# Altium schematic sheet EECS430PhasedArray.SchDoc
size B; ENG_APP_DATE: --/--/--; DSN_APP_DATE: --/--/--; CHK_APP_DATE: --/--/--; Organization: MASA; SheetNumber: 1; SheetTotal: 6
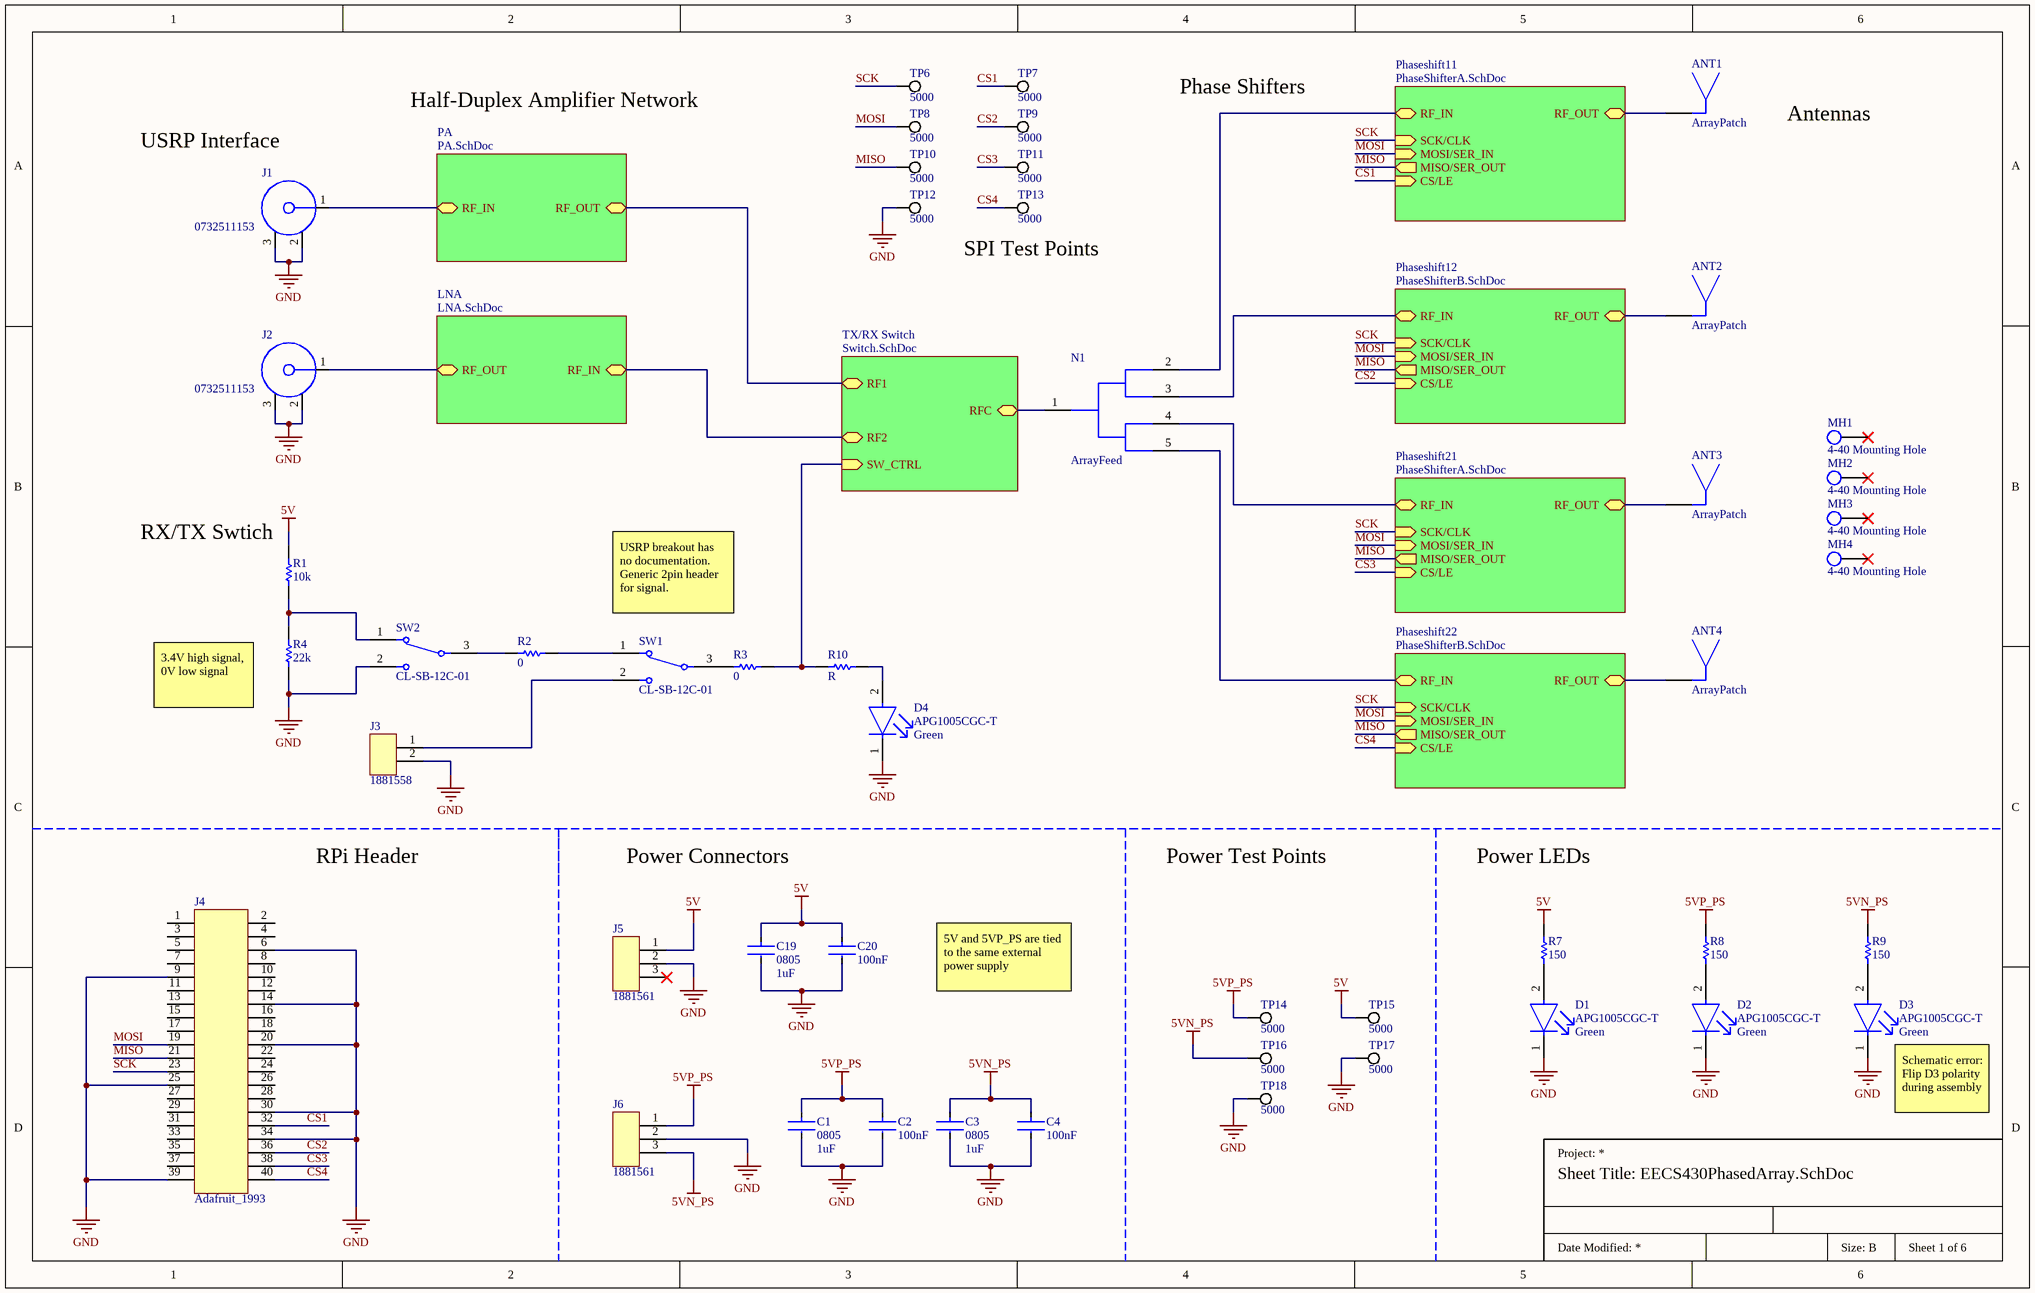
[diagram p0: EECS430PhasedArray.SchDoc]

## Parts
ANT1  ArrayPatch  [ArrayPatch]
ANT2  ArrayPatch  [ArrayPatch]
ANT3  ArrayPatch  [ArrayPatch]
ANT4  ArrayPatch  [ArrayPatch]
C1  value 1uF  Package: 0805  [FP-0805-Capacitor-CL21-IPC_B]  (hidden comment: Ceramic Capacitor 0805)
C2  value 100nF  [FP-0603-Capacitor-CL10-IPC_B]  (hidden comment: Ceramic Capacitor 0603)
C3  value 1uF  Package: 0805  [FP-0805-Capacitor-CL21-IPC_B]  (hidden comment: Ceramic Capacitor 0805)
C4  value 100nF  [FP-0603-Capacitor-CL10-IPC_B]  (hidden comment: Ceramic Capacitor 0603)
C19  value 1uF  Package: 0805  [FP-0805-Capacitor-CL21-IPC_B]  (hidden comment: Ceramic Capacitor 0805)
C20  value 100nF  [FP-0603-Capacitor-CL10-IPC_B]  (hidden comment: Ceramic Capacitor 0603)
D1  APG1005CGC-T  Color: Green  [FP-APG1005CGC-T-MFG]
D2  APG1005CGC-T  Color: Green  [FP-APG1005CGC-T-MFG]
D3  APG1005CGC-T  Color: Green  [FP-APG1005CGC-T-MFG]
D4  APG1005CGC-T  Color: Green  [FP-APG1005CGC-T-MFG]
J1  0732511153  [0732511153]
J2  0732511153  [0732511153]
J3  1881558  [1881558]
J4  Adafruit_1993  [Aadafruit_1993]
J5  1881561  [1881561]
J6  1881561  [1881561]
MH1  4-40 Mounting Hole  [4-40 Mounting Hole]
MH2  4-40 Mounting Hole  [4-40 Mounting Hole]
MH3  4-40 Mounting Hole  [4-40 Mounting Hole]
MH4  4-40 Mounting Hole  [4-40 Mounting Hole]
N1  ArrayFeed  [ArrayFeed]  (net tie, no BOM)
R1  value 10k  [RESC1608X55X25NL10T15]  (hidden comment: RC0603FR-072K2L)
R2  value 0  [RESC1608X55X25NL10T15]  (hidden comment: RC0603FR-072K2L)
R3  value 0  [RESC1608X55X25NL10T15]  (hidden comment: RC0603FR-072K2L)
R4  value 22k  [RESC1608X55X25NL10T15]  (hidden comment: RC0603FR-072K2L)
R7  value 150  [RESC1608X55X25NL10T15]  (hidden comment: RC0603FR-072K2L)
R8  value 150  [RESC1608X55X25NL10T15]  (hidden comment: RC0603FR-072K2L)
R9  value 150  [RESC1608X55X25NL10T15]  (hidden comment: RC0603FR-072K2L)
R10  value R  [RESC1608X55X25NL10T15]  (hidden comment: RC0603FR-072K2L)
SW1  CL-SB-12C-01  [CL-SB-12C-01]
SW2  CL-SB-12C-01  [CL-SB-12C-01]
TP6  5000  [FP-5000-MFG]
TP7  5000  [FP-5000-MFG]
TP8  5000  [FP-5000-MFG]
TP9  5000  [FP-5000-MFG]
TP10  5000  [FP-5000-MFG]
TP11  5000  [FP-5000-MFG]
TP12  5000  [FP-5000-MFG]
TP13  5000  [FP-5000-MFG]
TP14  5000  [FP-5000-MFG]
TP15  5000  [FP-5000-MFG]
TP16  5000  [FP-5000-MFG]
TP17  5000  [FP-5000-MFG]
TP18  5000  [FP-5000-MFG]

## Sub-sheets
LNA = LNA.SchDoc: RF_OUT (bidir), RF_IN (bidir)
PA = PA.SchDoc: RF_IN (bidir), RF_OUT (bidir)
Phaseshift11 = PhaseShifterA.SchDoc: SCK/CLK (in), MOSI/SER_IN (in), MISO/SER_OUT (out), CS/LE (in), RF_IN (bidir), RF_OUT (bidir)
Phaseshift12 = PhaseShifterB.SchDoc: SCK/CLK (in), MOSI/SER_IN (in), MISO/SER_OUT (out), CS/LE (in), RF_IN (bidir), RF_OUT (bidir)
Phaseshift21 = PhaseShifterA.SchDoc: SCK/CLK (in), MOSI/SER_IN (in), MISO/SER_OUT (out), CS/LE (in), RF_IN (bidir), RF_OUT (bidir)
Phaseshift22 = PhaseShifterB.SchDoc: SCK/CLK (in), MOSI/SER_IN (in), MISO/SER_OUT (out), CS/LE (in), RF_IN (bidir), RF_OUT (bidir)
TX/RX Switch = Switch.SchDoc: RFC (bidir), RF1 (bidir), RF2 (bidir), SW_CTRL (in)

## Nets
5V: C19.1 C20.1 J5.1 R1.2 R7.2 TP15.1
5VN_PS: C3.1 C4.1 J6.3 R9.1 TP16.1
5VP_PS: C1.1 C2.1 J6.1 R8.2 TP14.1
GND: C1.2 C2.2 C3.2 C4.2 C19.2 C20.2 D1.1(C) D2.1(C) D3.1(C) D4.1(C) J1.2 J1.3 J2.2 J2.3 J3.2 J4.6 J4.9 J4.14 J4.20 J4.25 J4.30 J4.34 J4.39 J5.2 J6.2 R4.1 SW2.2 TP12.1 TP17.1 TP18.1
CS1: J4.32 TP7.1 ; sheet Phaseshift11/CS/LE
CS2: J4.36 TP9.1 ; sheet Phaseshift12/CS/LE
CS3: J4.38 TP11.1 ; sheet Phaseshift21/CS/LE
CS4: J4.40 TP13.1 ; sheet Phaseshift22/CS/LE
MISO: J4.21 TP10.1 ; sheet Phaseshift11/MISO/SER_OUT, sheet Phaseshift12/MISO/SER_OUT, sheet Phaseshift21/MISO/SER_OUT, sheet Phaseshift22/MISO/SER_OUT
MOSI: J4.19 TP8.1 ; sheet Phaseshift11/MOSI/SER_IN, sheet Phaseshift12/MOSI/SER_IN, sheet Phaseshift21/MOSI/SER_IN, sheet Phaseshift22/MOSI/SER_IN
SCK: J4.23 TP6.1 ; sheet Phaseshift11/SCK/CLK, sheet Phaseshift12/SCK/CLK, sheet Phaseshift21/SCK/CLK, sheet Phaseshift22/SCK/CLK
NetANT1_1: ANT1.1(ANT) ; sheet Phaseshift11/RF_OUT
NetANT2_1: ANT2.1(ANT) ; sheet Phaseshift12/RF_OUT
NetANT3_1: ANT3.1(ANT) ; sheet Phaseshift21/RF_OUT
NetANT4_1: ANT4.1(ANT) ; sheet Phaseshift22/RF_OUT
NetD1_2: D1.2(A) R7.1
NetD2_2: D2.2(A) R8.1
NetD3_2: D3.2(A) R9.2
NetD4_2: D4.2(A) R10.1
NetJ1_1: J1.1 ; sheet PA/RF_IN
NetJ2_1: J2.1 ; sheet LNA/RF_OUT
NetJ3_1: J3.1 SW1.2
NetN1_1: N1.1(RFC) ; sheet TX/RX Switch/RFC
NetN1_2: N1.2(RF1) ; sheet Phaseshift11/RF_IN
NetN1_3: N1.3(RF2) ; sheet Phaseshift12/RF_IN
NetN1_4: N1.4(RF3) ; sheet Phaseshift21/RF_IN
NetN1_5: N1.5(RF4) ; sheet Phaseshift22/RF_IN
NetR1_1: R1.1 R4.2 SW2.1
NetR2_1: R2.1 SW1.1
NetR2_2: R2.2 SW2.3
NetR3_1: R3.1 R10.2 ; sheet TX/RX Switch/SW_CTRL
NetR3_2: R3.2 SW1.3
(unnamed): sheet LNA/RF_IN, sheet TX/RX Switch/RF2
(unnamed): sheet PA/RF_OUT, sheet TX/RX Switch/RF1

Not connected (* = marked no-connect by the designer): J4 1 2 3 4 5 7 8 10 11 12 13 15 16 17 18 22 24 26 27 28 29 31 33 35 37; J5 3*; MH1 1*; MH2 1*; MH3 1*; MH4 1*

## Notes on the sheet
- Half-Duplex Amplifier Network
- Phase Shifters
- USRP Interface
- Antennas
- (near TP13) SPI Test Points
- (near R1) RX/TX Swtich
- USRP breakout has no documentation.
  Generic 2pin header for signal.
- (near R4) 3.4V high signal, 0V low signal
- RPi Header
- Power Connectors
- Power Test Points
- Power LEDs
- 5V and 5VP_PS are tied to the same external power supply
- (near D3) Schematic error:
  Flip D3 polarity during assembly
- Size: B

## Library data of the parts
ANT1-ANT4 = ArrayPatch: Copper footprint for patch antenna element
C1 C3 C19 = Ceramic Capacitor 0805: CAP CER 50V X7R 0805; Manufacturer: KEMET; Manufacturer Part Number: C0603C104K5RACTU; Tolerance: 0.1; Temperature Coefficient: 30ppm/°C; Automotive Grade: Grade 1; Temperature: -55°C to +125°C; RoHS: TRUE; Material: Ceramic; Temperature Range High: +125°C; Lead Free: Yes; Octopart: https://octopart.com/c0603c104k5ractu-kemet-139244; Digikey Description: CAP CER 0.1UF 50V X7R 0603; Category: Cap; ComponentLink2Description: Datasheet; Temperature Range Low: -55°C; Device Class L1: Passive Components; Voltage Rating: 50 V; Automotive: Yes; Device Class L3: Ceramic Capacitors; ComponentLink2URL: https://api.kemet.com/component-edge/download/datasheet/C0603C100J5GACAUTO.pdf; Device Class L2: Capacitors; Temperature Characteristic: X7R; Height: 0.87mm; Supplier 1: Arrow Electronics; Supplier Part Number 1: CL21B105KBFNNNG
C2 C4 C20 = Ceramic Capacitor 0603: CAP CER 50V X7R 0603; Manufacturer: KEMET; Manufacturer Part Number: C0603C104K5RACTU; Tolerance: 0.1; Temperature Coefficient: 30ppm/°C; Automotive Grade: Grade 1; Temperature: -55°C to +125°C; RoHS: TRUE; Material: Ceramic; Temperature Range High: +125°C; Lead Free: Yes; Octopart: https://octopart.com/c0603c104k5ractu-kemet-139244; Digikey Description: CAP CER 0.1UF 50V X7R 0603; Category: Cap; Package: C0603C-CF; ComponentLink2Description: Datasheet; Temperature Range Low: -55°C; Device Class L1: Passive Components; Voltage Rating: 50 V; Automotive: Yes; Device Class L3: Ceramic Capacitors; ComponentLink2URL: https://api.kemet.com/component-edge/download/datasheet/C0603C100J5GACAUTO.pdf; Device Class L2: Capacitors; Temperature Characteristic: X7R; Height: 0.87mm; Supplier 1: Arrow Electronics; Supplier Part Number 1: CL10B104KB8NNNC
D1-D4 = APG1005CGC-T: LED GREEN CLEAR CHIP SMD; Forward Voltage: 2V; Lens Color: Colorless; Test Current: 20mA; Dominant Wavelength: 571nm; Viewing Angle: 120°; Luminous Intensity: 35mcd; Width: 0.5mm; Case Code (Imperial): 0402; Package Quantity: 1; Case/Package: 0402; Packaging: Tape and Reel; Height: 0.25mm; Mount: Surface Mount; Case Code (Metric): 1005; Length: 1mm; Lead Free: Lead Free; Lens Transparency: Clear; Supplier 1: Digi-Key; Supplier Part Number 1: 754-1811-1-ND
J1 J2 = 0732511153: SMA Connector Jack, Female Socket 50 Ohms Board Edge, End Launch Solder
J3 = 1881558: 2 Position Terminal Block Header, Male Pins, Shrouded (4 Side) 0.098" (2.50mm) Vertical Through Hole; Supplier 1: Mouser; Supplier Part Number 1: 651-1881558
J4 = Adafruit_1993: 2x20 pin Male IDC Box Header - Raspberry Pi A+/B+/Pi 2/Pi 3/Pi 4
J5 J6 = 1881561: 3 Position Terminal Block Header, Male Pins, Shrouded (4 Side) 0.098" (2.50mm) Vertical Through Hole; Supplier 1: Mouser; Supplier Part Number 1: 651-1881561
N1 = ArrayFeed: Copper net tie for 1:4 splitter/combiner
R1-R4 R7-R10 = Resistor 0603: Thick Film Resistor, 2.2 KOhm, 100 mW, 50 V, +/- 1%, -55 to 155 degC, 2-Pin SMD (0603), RoHS, Tape and Reel; Manufacturer: Yageo; Temperature Coefficient: 100PPM/C; Voltage Rating: 50V; Power Rating: 100mW; Tolerance: 1%; Datasheet Version: Rev. 7, 05/2017; Case Code - mm: 1608; Series: RC; Mounting Technology: SurfaceMount; Package Description: 2-Pin Surface Mount Device, Body 1.6 x 0.8 mm; Case Code - in: 0603; Package Reference: 0603; Product: ThickFilmResistorsGeneralPurpose; Manufacturer URL: http://www.yageo.com/; Termination Style: SMD/SMT; Operating Temperature Range: -55Cto+155C; Datasheet URL: http://www.yageo.com/documents/recent/PYu-RC_Group_51_RoHS_L_7.pdf; Packaging: Reel
SW1 SW2 = CL-SB-12C-01: Slide Switch SPDT Through Hole; Supplier 1: Newark; Supplier Part Number 1: 97AH8227
TP6-TP18 = 5000: Red PC Test Point, Miniature Phosphor Bronze Silver Plating Through Hole Mounting Type; Connector Type: Interconnection Device; Contact Finish - Termination: Silver (Ag); Reach SVHC Compliant: Yes; JESD-609 Code: e4; RoHS Compliant: Yes; Pins: 1; Mounting Technology: THT; Supplier 1: Future Electronics; Supplier Part Number 1: 8000564